# Altium schematic sheet IN_12A.SchDoc
size 431 x 279 mm; SheetNumber: 3; SheetTotal: 6
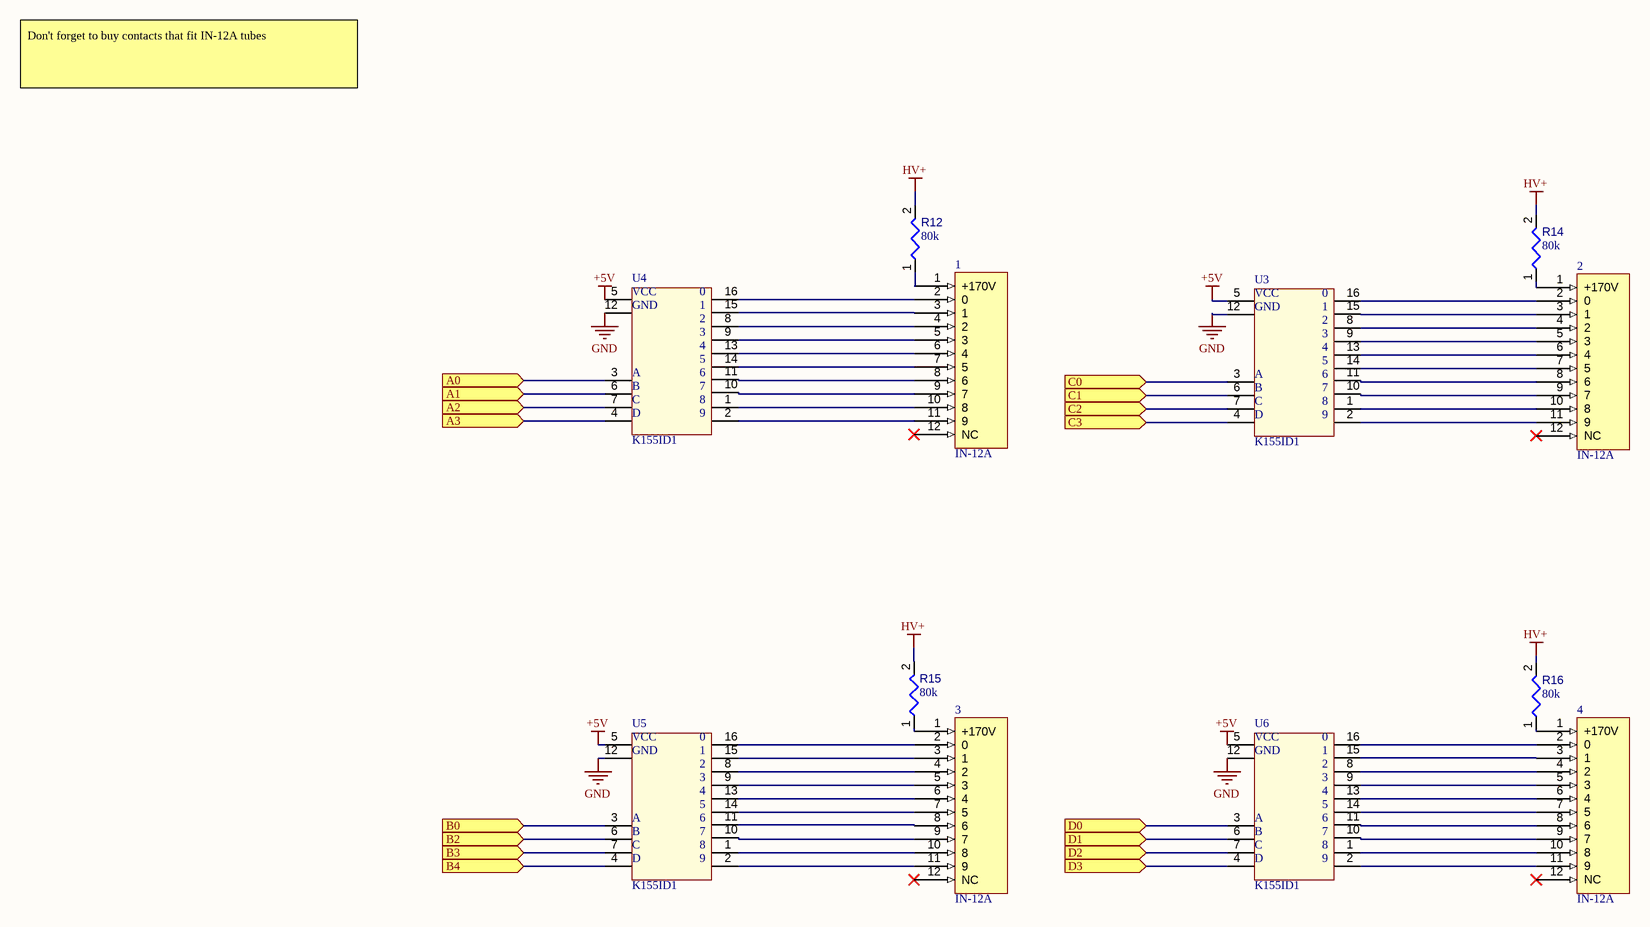
[diagram p0: IN_12A.SchDoc]

## Parts
1  IN-12A  [IN-12A]
2  IN-12A  [IN-12A]
3  IN-12A  [IN-12A]
4  IN-12A  [IN-12A]
R12  value 80k  [RESC3216X60X45ML15T20]  (hidden comment: Resistor 80k +/-1% 1206 250 mW)
R14  value 80k  [RESC3216X60X45ML15T20]  (hidden comment: Resistor 80k +/-1% 1206 250 mW)
R15  value 80k  [RESC3216X60X45ML15T20]  (hidden comment: Resistor 80k +/-1% 1206 250 mW)
R16  value 80k  [RESC3216X60X45ML15T20]  (hidden comment: Resistor 80k +/-1% 1206 250 mW)
U3  K155ID1  [Socket_DIP_16]
U4  K155ID1  [Socket_DIP_16]
U5  K155ID1  [Socket_DIP_16]
U6  K155ID1  [Socket_DIP_16]

## Ports
A0 (in), A1 (in), A2 (in), A3 (in), B0 (in), B2 (in), B3 (in), B4 (in), C0 (in), C1 (in), C2 (in), C3 (in), D0 (in), D1 (in), D2 (in), D3 (in)

## Nets
+5V: U3.5 U4.5 U5.5 U6.5
GND: U3.12 U4.12 U5.12 U6.12
HV+: R12.2 R14.2 R15.2 R16.2
A0: U4.3 ; port A0
A1: U4.6 ; port A1
A2: U4.7 ; port A2
A3: U4.4 ; port A3
B0: U5.3 ; port B0
B2: U5.6 ; port B2
B3: U5.7 ; port B3
B4: U5.4 ; port B4
C0: U3.3 ; port C0
C1: U3.6 ; port C1
C2: U3.7 ; port C2
C3: U3.4 ; port C3
D0: U6.3 ; port D0
D1: U6.6 ; port D1
D2: U6.7 ; port D2
D3: U6.4 ; port D3
Net1_1: 1.1(+170V) R12.1
Net1_2: 1.2(0) U4.16
Net1_3: 1.3(1) U4.15
Net1_4: 1.4(2) U4.8
Net1_5: 1.5(3) U4.9
Net1_6: 1.6(4) U4.13
Net1_7: 1.7(5) U4.14
Net1_8: 1.8(6) U4.11
Net1_9: 1.9(7) U4.10
Net1_10: 1.10(8) U4.1
Net1_11: 1.11(9) U4.2
Net2_1: 2.1(+170V) R14.1
Net2_2: 2.2(0) U3.16
Net2_3: 2.3(1) U3.15
Net2_4: 2.4(2) U3.8
Net2_5: 2.5(3) U3.9
Net2_6: 2.6(4) U3.13
Net2_7: 2.7(5) U3.14
Net2_8: 2.8(6) U3.11
Net2_9: 2.9(7) U3.10
Net2_10: 2.10(8) U3.1
Net2_11: 2.11(9) U3.2
Net3_1: 3.1(+170V) R15.1
Net3_2: 3.2(0) U5.16
Net3_3: 3.3(1) U5.15
Net3_4: 3.4(2) U5.8
Net3_5: 3.5(3) U5.9
Net3_6: 3.6(4) U5.13
Net3_7: 3.7(5) U5.14
Net3_8: 3.8(6) U5.11
Net3_9: 3.9(7) U5.10
Net3_10: 3.10(8) U5.1
Net3_11: 3.11(9) U5.2
Net4_1: 4.1(+170V) R16.1
Net4_2: 4.2(0) U6.16
Net4_3: 4.3(1) U6.15
Net4_4: 4.4(2) U6.8
Net4_5: 4.5(3) U6.9
Net4_6: 4.6(4) U6.13
Net4_7: 4.7(5) U6.14
Net4_8: 4.8(6) U6.11
Net4_9: 4.9(7) U6.10
Net4_10: 4.10(8) U6.1
Net4_11: 4.11(9) U6.2

Not connected (* = marked no-connect by the designer): 1 12(NC)*; 2 12(NC)*; 3 12(NC)*; 4 12(NC)*

## Notes on the sheet
- Don't forget to buy contacts that fit IN-12A tubes
- DWG. NO.
- REV.
- SHT.
- THIS DOCUMENT AND THE DATA DISCLOSED HEREIN OR HEREWITH IS THE PROPERTY OF ALTIUM LIMITED AND MAY BE FREELY DISTRIBUTED IN WHOLE. NO RIGHTS ARE RESERVED OR EXPRESS OR IMPLIED WARANTEE GIVEN.
- REVISION
- DESCRIPTION
- DATE
- APPROVED
- ENG:
- APPROVALS
- PROJECT
- DSN:
- CHK:
- REFERENCE DOCUMENTS
- PROJECT REVISION:
- TITLE
- DOCUMENT REVISION:
- DESIGN ITEM:
- BOM:
- FAB DWG:
- PCB DWG:
- ASSY DWG:
- SCALE:
- SIZE
- B
- CAGE CODE
- FILE NAME
- DWG NO.
- SHEET
- OF
- REV
- (in symbol K155ID1) VCC; 0; GND; A; B; C; D

## Library data of the parts
R12 R14-R16 = CMP-009-00016-4: Chip Resistor, 80 KOhm, +/- 1%, 0.25 W, -55 to 155 degC, 1206 (3216 Metric); Power: 250mW; Voltage Rating: 200V; Max Operating Temperature: 155°C; Mounting Technology: SM; Case/Package: 1206; Pins: 2; Min Operating Temperature: -55°C; RoHS Compliant: True; Tolerance: 1%